# Altium schematic sheet USB_PCB.SchDoc
size A3
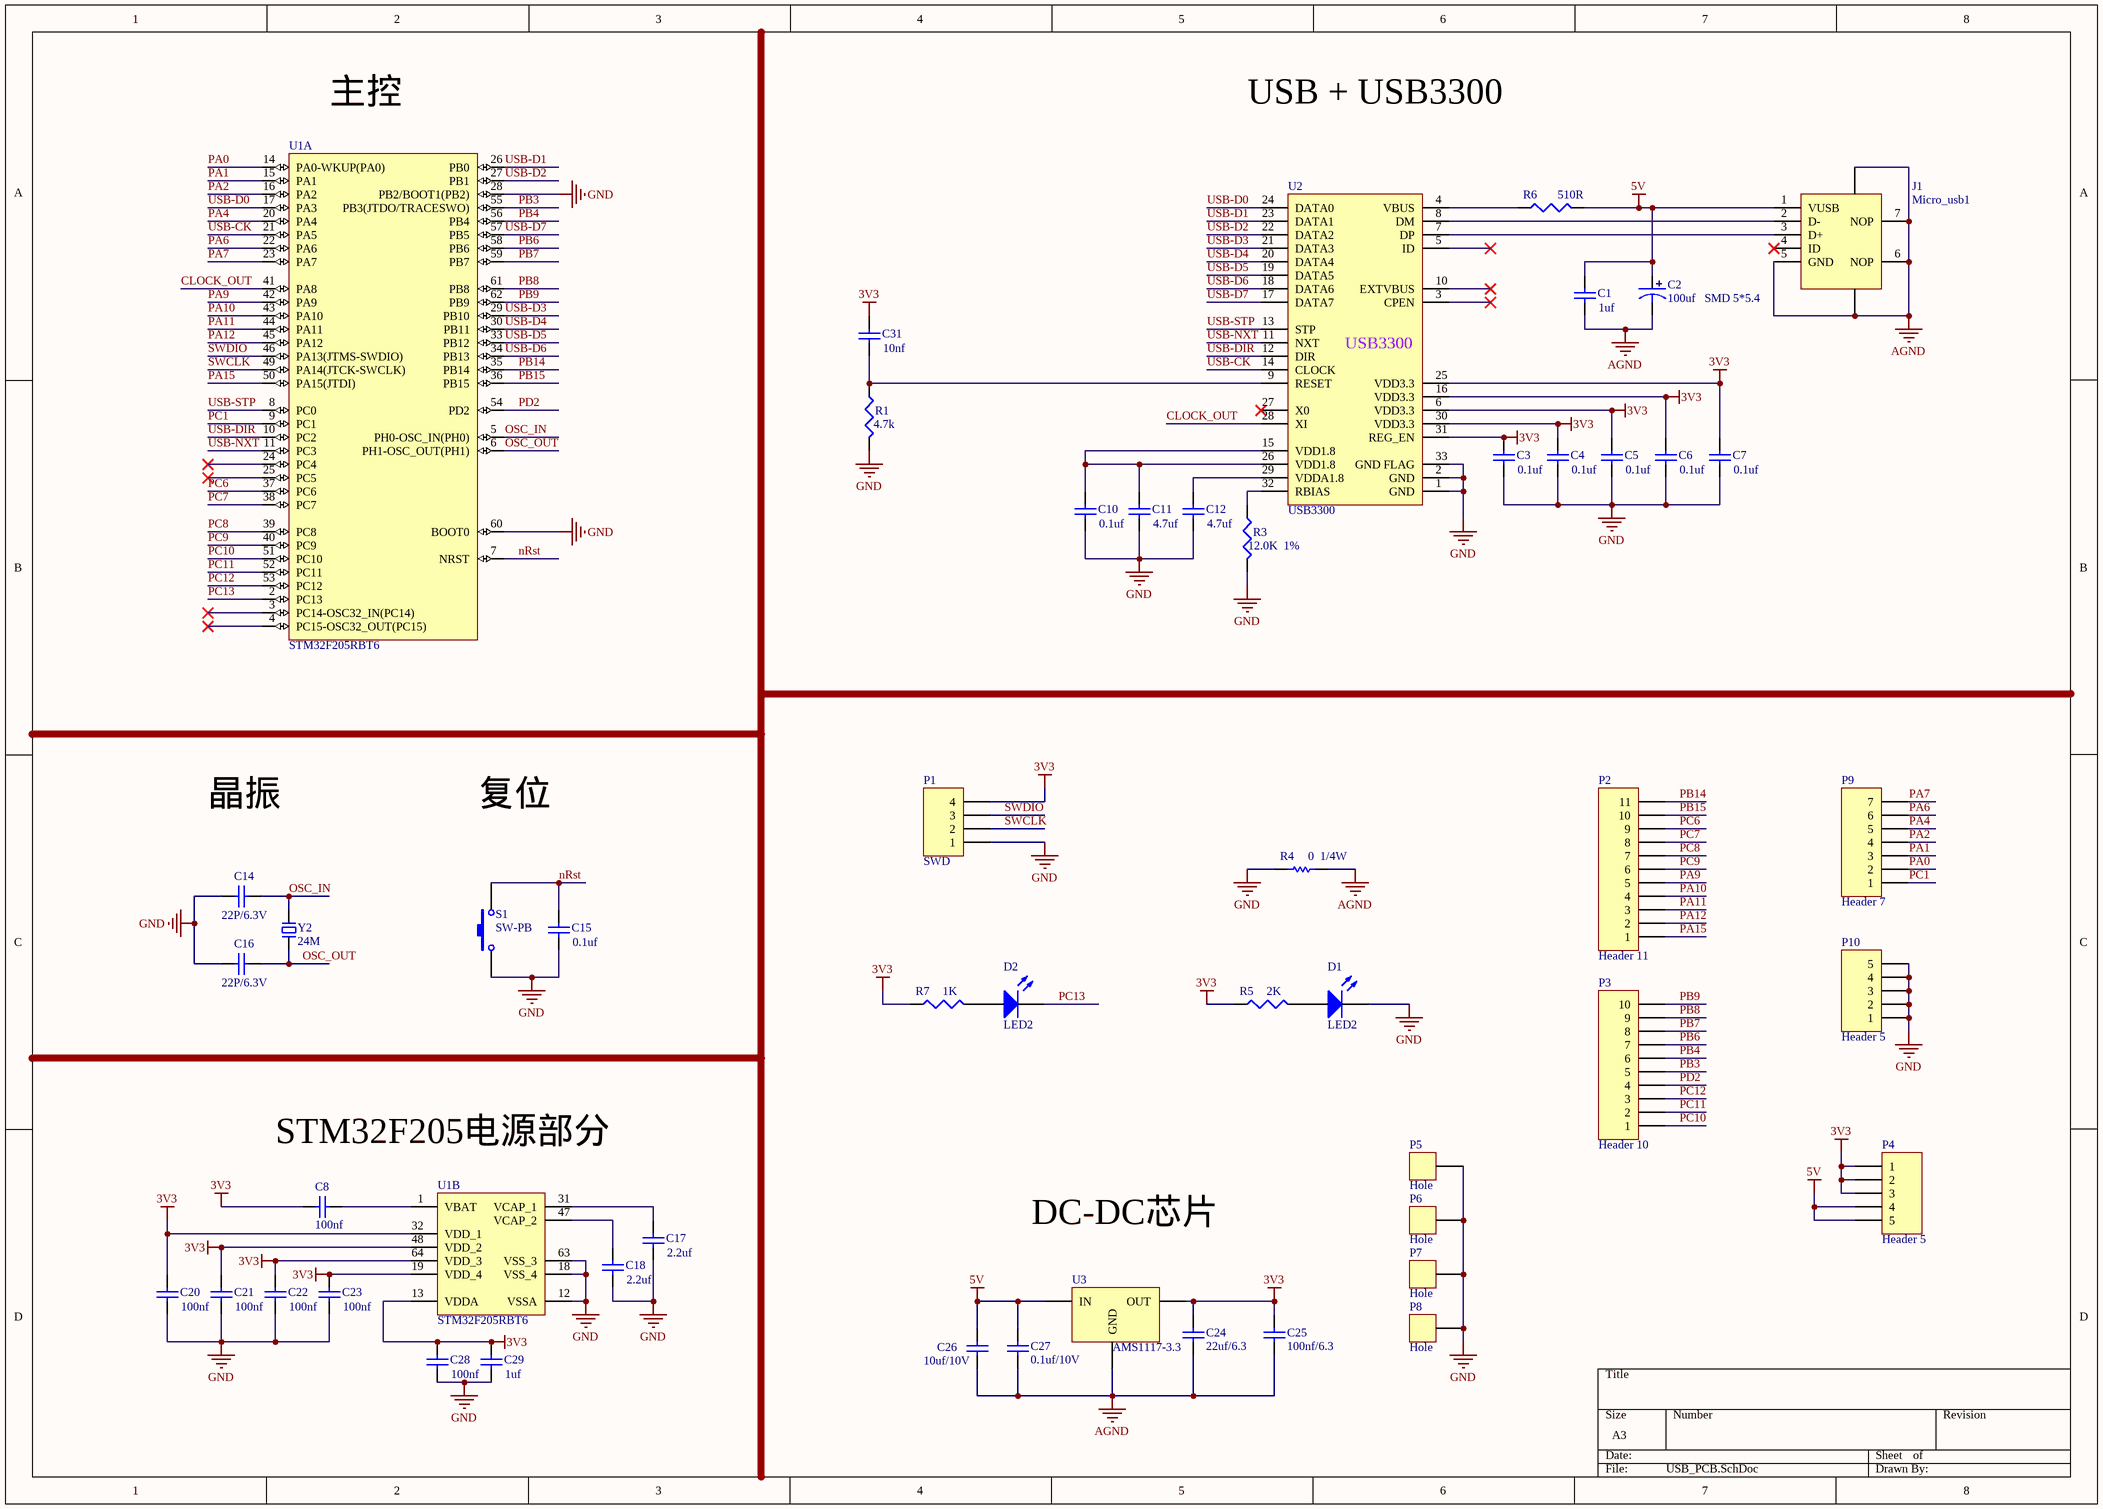
[diagram p0: USB_PCB.SchDoc]

## Parts
C1  1uf  [j1-0603]
C2  100uf   SMD 5*5.4  [SMD-EC5.0X5.3X5.4]
C3  0.1uf  [j1-0603]
C4  0.1uf  [j1-0603]
C5  0.1uf  [j1-0603]
C6  0.1uf  [j1-0603]
C7  0.1uf  [j1-0603]
C8  100nf  [j1-0603]
C10  0.1uf  [j1-0603]
C11  4.7uf  [j1-0603]
C12  4.7uf  [j1-0603]
C14  22P/6.3V  [J1-0603]
C15  0.1uf  [j1-0603]
C16  22P/6.3V  [J1-0603]
C17  2.2uf  [j1-0603]
C18  2.2uf  [j1-0603]
C20  100nf  [j1-0603]
C21  100nf  [j1-0603]
C22  100nf  [j1-0603]
C23  100nf  [j1-0603]
C24  22uf/6.3  [J1-0603]
C25  100nf/6.3  [J1-0603]
C26  10uf/10V  [J1-0603]
C27  0.1uf/10V  [J1-0603]
C28  100nf  [j1-0603]
C29  1uf  [j1-0603]
C31  10nf  [j1-0603]
D1  LED2  [j1-0603]
D2  LED2  [j1-0603]
J1  Micro_usb1  [Micro_USB1]
P1  SWD  [HDR1X4]
P2  Header 11  [HDR1X11]
P3  Header 10  [HDR1X10]
P4  Header 5  [HDR1X5]
P5  Hole  [Hole]
P6  Hole  [Hole]
P7  Hole  [Hole]
P8  Hole  [Hole]
P9  Header 7  [HDR1X7]
P10  Header 5  [HDR1X5]
R1  4.7k  [J1-0603]
R3  12.0K  1%  [J1-0603]
R4  0  1/4W  [AXIAL0.4]
R5  2K  [J1-0603]
R6  510R  [J1-0603]
R7  1K  [J1-0603]
S1  SW-PB  [TD-19XA]
U1  STM32F205RBT6  [STM-LQFP64_N]  (parts A,B of 2)
U2  USB3300  [QFN32_L]
U3  AMS1117-3.3  [SOT-223]
Y2  24M  [OSC 5032-2P]

## Nets
3V3: C3.2 C4.2 C5.2 C6.2 C7.2 C8.2 C20.2 C21.2 C22.2 C23.2 C24.2 C25.2 C28.2 C29.2 C31.2 P1.4 P4.1 P4.2 P4.3 R5.1 R7.1 U1.13(VDDA) U1.19(VDD_4) U1.32(VDD_1) U1.48(VDD_2) U1.64(VDD_3) U2.6(VDD3.3) U2.16(VDD3.3) U2.25(VDD3.3) U2.30(VDD3.3) U2.31(REG_EN) U3.2(OUT)
5V: C1.2 C2.1 C26.2 C27.2 J1.1(VUSB) P4.4 P4.5 R6.2 U3.3(IN)
AGND: C1.1 C2.2 C24.1 C25.1 C26.1 C27.1 J1.5(GND) J1.6(NOP) J1.7(NOP) J1.8 J1.9 R4.2 U3.1(GND)
GND: C3.1 C4.1 C5.1 C6.1 C7.1 C10.1 C11.1 C12.1 C14.1 C15.1 C16.1 C17.1 C18.1 C20.1 C21.1 C22.1 C23.1 C28.1 C29.1 D1.2(K) P1.1 P5.1 P6.1 P7.1 P8.1 P10.1 P10.2 P10.3 P10.4 P10.5 R1.2 R3.2 R4.1 S1.1 U1.12(VSSA) U1.18(VSS_4) U1.28(PB2/BOOT1(PB2)) U1.60(BOOT0) U1.63(VSS_3) U2.1(GND) U2.2(GND) U2.33(GND_FLAG)
CLOCK_OUT: U1.41(PA8) U2.28(XI)
nRst: C15.2 S1.2 U1.7(NRST)
OSC_IN: C14.2 U1.5(PH0-OSC_IN(PH0)) Y2.2
OSC_OUT: C16.2 U1.6(PH1-OSC_OUT(PH1)) Y2.1
PA0: P9.2 U1.14(PA0-WKUP(PA0))
PA1: P9.3 U1.15(PA1)
PA2: P9.4 U1.16(PA2)
PA4: P9.5 U1.20(PA4)
PA6: P9.6 U1.22(PA6)
PA7: P9.7 U1.23(PA7)
PA9: P2.5 U1.42(PA9)
PA10: P2.4 U1.43(PA10)
PA11: P2.3 U1.44(PA11)
PA12: P2.2 U1.45(PA12)
PA15: P2.1 U1.50(PA15(JTDI))
PB3: P3.5 U1.55(PB3(JTDO/TRACESWO))
PB4: P3.6 U1.56(PB4)
PB6: P3.7 U1.58(PB6)
PB7: P3.8 U1.59(PB7)
PB8: P3.9 U1.61(PB8)
PB9: P3.10 U1.62(PB9)
PB14: P2.11 U1.35(PB14)
PB15: P2.10 U1.36(PB15)
PC1: P9.1 U1.9(PC1)
PC6: P2.9 U1.37(PC6)
PC7: P2.8 U1.38(PC7)
PC8: P2.7 U1.39(PC8)
PC9: P2.6 U1.40(PC9)
PC10: P3.1 U1.51(PC10)
PC11: P3.2 U1.52(PC11)
PC12: P3.3 U1.53(PC12)
PC13: D2.2(K) U1.2(PC13)
PD2: P3.4 U1.54(PD2)
SWCLK: P1.2 U1.49(PA14(JTCK-SWCLK))
SWDIO: P1.3 U1.46(PA13(JTMS-SWDIO))
USB-CK: U1.21(PA5) U2.14(CLOCK)
USB-D0: U1.17(PA3) U2.24(DATA0)
USB-D1: U1.26(PB0) U2.23(DATA1)
USB-D2: U1.27(PB1) U2.22(DATA2)
USB-D3: U1.29(PB10) U2.21(DATA3)
USB-D4: U1.30(PB11) U2.20(DATA4)
USB-D5: U1.33(PB12) U2.19(DATA5)
USB-D6: U1.34(PB13) U2.18(DATA6)
USB-D7: U1.57(PB5) U2.17(DATA7)
USB-DIR: U1.10(PC2) U2.12(DIR)
USB-NXT: U1.11(PC3) U2.11(NXT)
USB-STP: U1.8(PC0) U2.13(STP)
NetC8_1: C8.1 U1.1(VBAT)
NetC10_2: C10.2 C11.2 U2.15(VDD1.8) U2.26(VDD1.8)
NetC12_2: C12.2 U2.29(VDDA1.8)
NetC17_2: C17.2 U1.31(VCAP_1)
NetC18_2: C18.2 U1.47(VCAP_2)
NetC31_1: C31.1 R1.1 U2.9(RESET)
NetD1_1: D1.1(A) R5.2
NetD2_1: D2.1(A) R7.2
NetJ1_2: J1.2(D-) U2.8(DM)
NetJ1_3: J1.3(D+) U2.7(DP)
NetR3_1: R3.1 U2.32(RBIAS)
NetR6_1: R6.1 U2.4(VBUS)

Not connected (* = marked no-connect by the designer): J1 4(ID)*; U1 3(PC14-OSC32_IN(PC14))* 4(PC15-OSC32_OUT(PC15))* 24(PC4)* 25(PC5)*; U2 3(CPEN)* 5(ID)* 10(EXTVBUS)* 27(X0)*

## Notes on the sheet
- 主控
- USB + USB3300
- 晶振
- 复位
- STM32F205电源部分
- DC-DC芯片

## Library data of the parts
C1 C3-C8 C11 C12 C17 C18 C20-C23 C28 C29 = Cap Semi: Capacitor (Semiconductor SIM Model); Published: 8-Jun-2000; LatestRevisionDate: 29-May-2009; LatestRevisionNote: IPC-7351 Footprint Added.; PackageReference: C1206; Publisher: Altium Limited; PackageDescription: Chip Capacitor
  C1 C29: Value: 1uf
  C3-C7: Value: 0.1uf
  C8 C20-C23 C28: Value: 100nf
  C11 C12: Value: 4.7uf
  C17 C18: Value: 2.2uf
C2 = SMD_ECAP: 贴片电解电容
C10 C31 = Cap Semi: Capacitor (Semiconductor SIM Model); Value: 4.7uf; Published: 8-Jun-2000; LatestRevisionDate: 29-May-2009; LatestRevisionNote: IPC-7351 Footprint Added.; PackageReference: C1206; Publisher: Altium Limited; PackageDescription: Chip Capacitor
C14 C16 C24-C27 = Cap: Capacitor; Published: 8-Jun-2000; LatestRevisionDate: 17-Jul-2002; LatestRevisionNote: Re-released for DXP Platform.; PackageReference: RAD-0.3; Publisher: Altium Limited; PackageDescription: Radial Cap, Thru-Hole; 2 Leads; 0.3 in Pin Spacing
C15 = Cap Semi: Capacitor (Semiconductor SIM Model); Value: 0.1uf/10V; Published: 8-Jun-2000; LatestRevisionDate: 29-May-2009; LatestRevisionNote: IPC-7351 Footprint Added.; PackageReference: C1206; Publisher: Altium Limited; PackageDescription: Chip Capacitor
D1 D2 = LED2: Typical RED, GREEN, YELLOW, AMBER GaAs LED; Published: 8-Jun-2000; LatestRevisionDate: 17-Jul-2002; LatestRevisionNote: Re-released for DXP Platform.; PackageVersion: Feb-2002; PackageReference: 3.2X1.6X1.1; Publisher: Altium Limited; PackageDescription: SM LED; 2 Flat Leads
P1 = Header 4: Header, 4-Pin; LatestRevisionDate: 17-Jul-2002; LatestRevisionNote: Re-released for DXP Platform.; Publisher: Altium Limited
P2 = Header 11: Header, 11-Pin; LatestRevisionDate: 17-Jul-2002; LatestRevisionNote: Re-released for DXP Platform.; Publisher: Altium Limited
P3 = Header 10: Header, 10-Pin; LatestRevisionDate: 17-Jul-2002; LatestRevisionNote: Re-released for DXP Platform.; Publisher: Altium Limited
P4 P10 = Header 5: Header, 5-Pin; LatestRevisionDate: 17-Jul-2002; LatestRevisionNote: Re-released for DXP Platform.; Publisher: Altium Limited
P9 = Header 7: Header, 7-Pin; LatestRevisionDate: 17-Jul-2002; LatestRevisionNote: Re-released for DXP Platform.; Publisher: Altium Limited
R1 R3 R5 R6 = Res3: Resistor; Value: 1K; Published: 8-Jun-2000; LatestRevisionDate: 29-May-2009; LatestRevisionNote: IPC-7351 Footprint Added.; PackageReference: J1-0603; Publisher: Altium Limited; PackageDescription: Chip Resistor
R4 = RES
R7 = Res3: Resistor; Published: 8-Jun-2000; LatestRevisionDate: 29-May-2009; LatestRevisionNote: IPC-7351 Footprint Added.; PackageReference: J1-0603; Publisher: Altium Limited; PackageDescription: Chip Resistor; Value: 1K
S1 = SW-PB: Switch; Published: 24-Mar-1999; LatestRevisionDate: 17-Jul-2002; LatestRevisionNote: Re-released for DXP Platform.; PackageReference: SPST-2; Publisher: Altium Limited; PackageDescription: Switch; 2 Leads
U1 = STM32F205RBT6: ARM Cortex-M3 32-bit MCU, 128 KB Flash, 64 KB Internal RAM, 51 I/Os, 64-pin LQFP, -40 to 85 degC, Tray; D/A Converter: 2x12-bit (2 Channel); FLASH Size (Prog) (kB): 128; I/Os (High Current): 51; Internal RAM Size (kB): 64; Operating Frequency(F) (Processor speed) (MHz): 120; Supply Voltage(Vcc) min (V): 1.8; DatasheetVersion: Rev. 9; PackageVersion: Rev. 4, 06/2013; PackageReference: LQFP64; PackageDescription: 64-Pin Low Profile Quad Flat Package, 10 x 10 mm Body, 0.5 mm Pitch; Supplier 1: Digi-Key; Supplier Part Number 1: 497-11153-ND; Supplier 2: Farnell; Supplier Part Number 2: 2060895; Supplier 3: Newark; Supplier Part Number 3: 47T9327; Core: ARM Cortex-M3; Packing: Tray; Mounting Technology: Surface Mount; PartNumber: STM32F205RBT6; ComponentLink1Description: Manufacturer URL; ComponentLink1URL: http://www.st.com/web/en/home.html; ComponentLink2Description: Datasheet; ComponentLink2URL: http://www.st.com/st-web-ui/static/active/en/resource/technical/document/datasheet/CD00237391.pdf; ComponentLink3Description: Package Specification; ComponentLink3URL: http://www.st.com/st-web-ui/static/active/en/resource/technical/document/datasheet/DM00037051.pdf
U3 = ASM1117
Y2 = XTAL-2P: 2脚无源脚晶振